# EAGLE schematic tube_pcb (EAGLE 7.7.0)
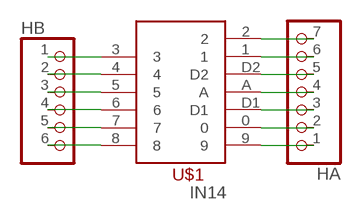
[diagram p0: schematic, sheet 1]

## Parts
HA  PINHD-1X7  [1X07]
HB  PINHD-1X6  [1X06]
U$1  IN14  [IN14]

## Nets
0: HA.2 U$1.0
1: HA.6 U$1.1
2: HA.7 U$1.2
3: HB.1 U$1.3
4: HB.2 U$1.4
5: HB.3 U$1.5
6: HB.4 U$1.6
7: HB.5 U$1.7
8: HB.6 U$1.8
9: HA.1 U$1.9
A: HA.4 U$1.A
D1: HA.3 U$1.D1
D2: HA.5 U$1.D2

## Library data of the parts
HA = pinhead:PINHD-1X7: PIN HEADER
HB = pinhead:PINHD-1X6: PIN HEADER
U$1 = my_library:IN14